# EAGLE schematic IMU_Board (EAGLE 9.6.2)
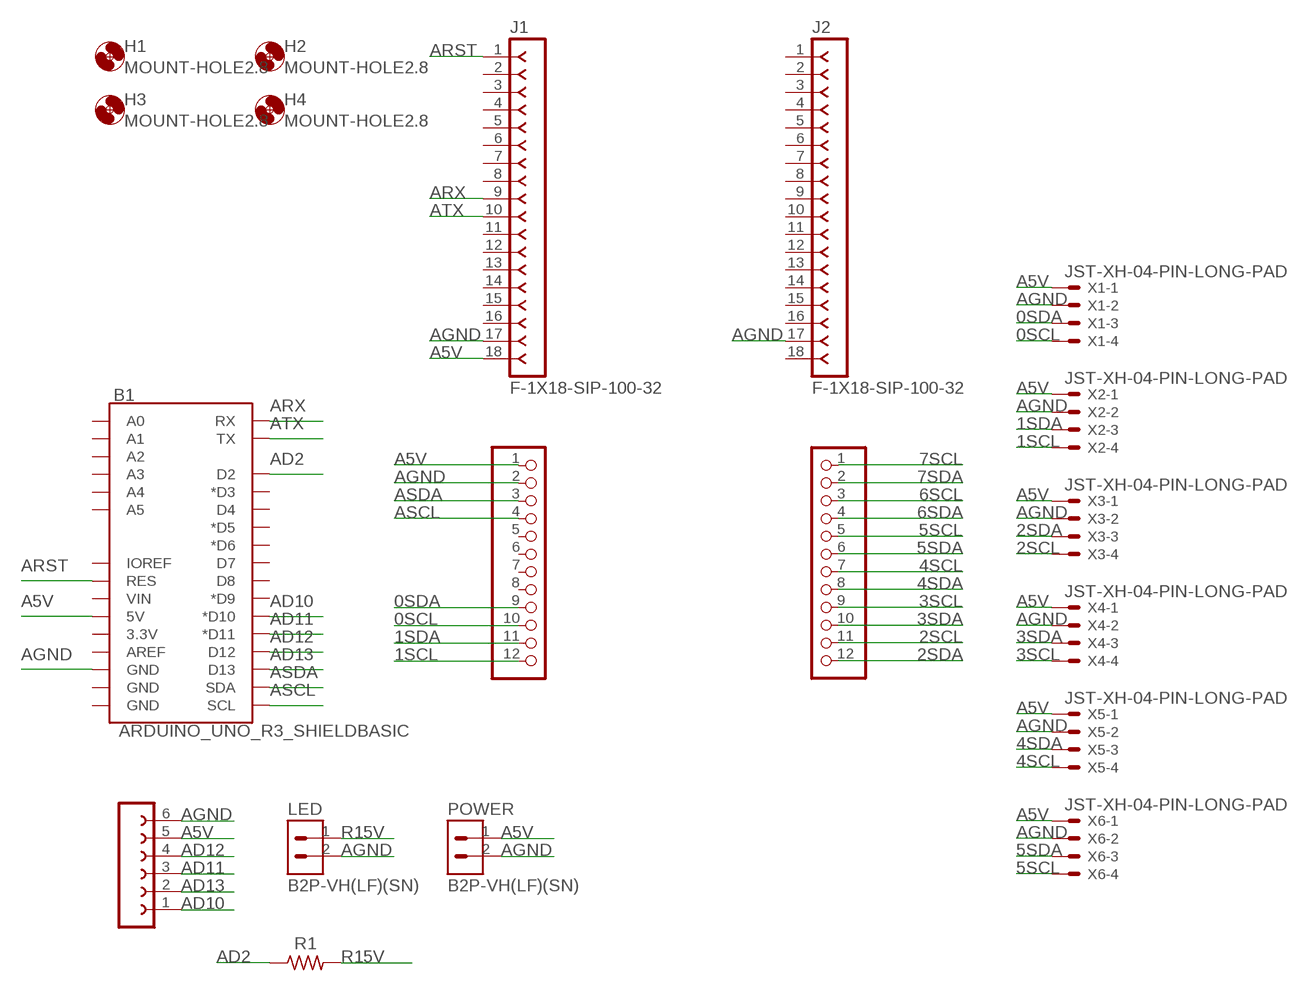
[diagram p0: schematic, sheet 1]

## Parts
B1  ARDUINO_UNO_R3_SHIELDBASIC  [UNO_R3_SHIELD]
H1  MOUNT-HOLE2.8  [2,8]
H2  MOUNT-HOLE2.8  [2,8]
H3  MOUNT-HOLE2.8  [2,8]
H4  MOUNT-HOLE2.8  [2,8]
J1  F-1X18-SIP-100-32  [SIP-100-18-32]
J2  F-1X18-SIP-100-32  [SIP-100-18-32]
JP1  HEADER-1X12  [1X12_ROUND]
JP3  HEADER-1X12  [1X12_ROUND]
LED  B2P-VH(LF)(SN)  [HDR-02]
POWER  B2P-VH(LF)(SN)  [HDR-02]
R1  R-US_AXIAL-11.7MM-PITCH  [RESAD1176W63L850D250B]
SD  FE06-1  [FE06]
X1  JST-XH-04-PIN-LONG-PAD  [JST-XH-04-PACKAGE-LONG-PAD]
X2  JST-XH-04-PIN-LONG-PAD  [JST-XH-04-PACKAGE-LONG-PAD]
X3  JST-XH-04-PIN-LONG-PAD  [JST-XH-04-PACKAGE-LONG-PAD]
X4  JST-XH-04-PIN-LONG-PAD  [JST-XH-04-PACKAGE-LONG-PAD]
X5  JST-XH-04-PIN-LONG-PAD  [JST-XH-04-PACKAGE-LONG-PAD]
X6  JST-XH-04-PIN-LONG-PAD  [JST-XH-04-PACKAGE-LONG-PAD]

## Nets
0SCL: JP3.10 X1.4
0SDA: JP3.9 X1.3
1SCL: JP3.12 X2.4
1SDA: JP3.11 X2.3
2SCL: JP1.11 X3.4
2SDA: JP1.12 X3.3
3SCL: JP1.9 X4.4
3SDA: JP1.10 X4.3
4SCL: JP1.7 X5.4
4SDA: JP1.8 X5.3
5SCL: JP1.5 X6.4
5SDA: JP1.6 X6.3
6SCL: JP1.3
6SDA: JP1.4
7SCL: JP1.1
7SDA: JP1.2
A5V: B1.5V J1.18 JP3.1 POWER.1 SD.5 X1.1 X2.1 X3.1 X4.1 X5.1 X6.1
AD2: B1.D2 R1.1
AD10: B1.D10(*D10) SD.1
AD11: B1.D11(*D11) SD.3
AD12: B1.D12 SD.4
AD13: B1.D13 SD.2
AGND: B1.GND@2(GND) J1.17 J2.17 JP3.2 LED.2 POWER.2 SD.6 X1.2 X2.2 X3.2 X4.2 X5.2 X6.2
ARST: B1.RES J1.1
ARX: B1.RX J1.9
ASCL: B1.SCL JP3.4
ASDA: B1.SDA JP3.3
ATX: B1.TX J1.10
R15V: LED.1 R1.2
Unconnected: B1.3.3V B1.A0 B1.A1 B1.A2 B1.A3 B1.A4 B1.A5 B1.AREF B1.D3(*D3) B1.D4 B1.D5(*D5) B1.D6(*D6) B1.D7 B1.D8 B1.D9(*D9) B1.GND@0(GND) B1.GND@1(GND) B1.IOREF B1.VIN J1.2 J1.3 J1.4 J1.5 J1.6 J1.7 J1.8 J1.11 J1.12 J1.13 J1.14 J1.15 J1.16 J2.1 J2.2 J2.3 J2.4 J2.5 J2.6 J2.7 J2.8 J2.9 J2.10 J2.11 J2.12 J2.13 J2.14 J2.15 J2.16 J2.18 JP3.5 JP3.6 JP3.7 JP3.8

## Library data of the parts
B1 = SparkFun-Boards:ARDUINO_UNO_R3_SHIELD: Arduino R3 Shield Footprint Shield form compatible with the Arduino Uno R3. SparkFun Products: MG2639 Cellular Shield <https://www.sparkfun.com/products/13120> MIDI Shield <https://www.sparkfun.com/products/12898> R3 Stackable Headers Kit <https://www.sparkfun.com/products/11417>
H1-H4 = holes:MOUNT-HOLE: MOUNTING HOLE with drill center marker
J1 J2 = con-headers-jp:F-1X18-: FEMALE HEADER
JP1 JP3 = microbuilder:HEADER-1X12
LED POWER = Connectors:B2P-VH(LF)(SN): CONN HEADER VERT 2POS 3.96MM Manufacturer's datasheet <http://www.jst-mfg.com/product/pdf/eng/eVH.pdf>; CREATED_BY: PCBLayout.com; DIGIKEY_PART_NUMBER: 455-1639-ND; MANUFACTURER: JST Sales America Inc.; MPN: B2P-VH(LF)(SN)
R1 = Resistor:R-US: Resistor Fixed - ANSI; CATEGORY: Resistor; SUB-CATEGORY: Fixed
SD = con-lsta:FE06-1: FEMALE HEADER; OC_FARNELL: unknown; OC_NEWARK: unknown
X1-X6 = Rembrandt Electronics - JST XH Connectors v1-0:JST-XH-04-PIN: JST XH Connector 2 Pin Wire to board connector. Pitch: 2,54 mm, (0.100") Number of pins: 4 Created by Rembrandt Electronics www.rembrandtelectronics.com